# EAGLE design Board_3 (EAGLE 9.0.1)
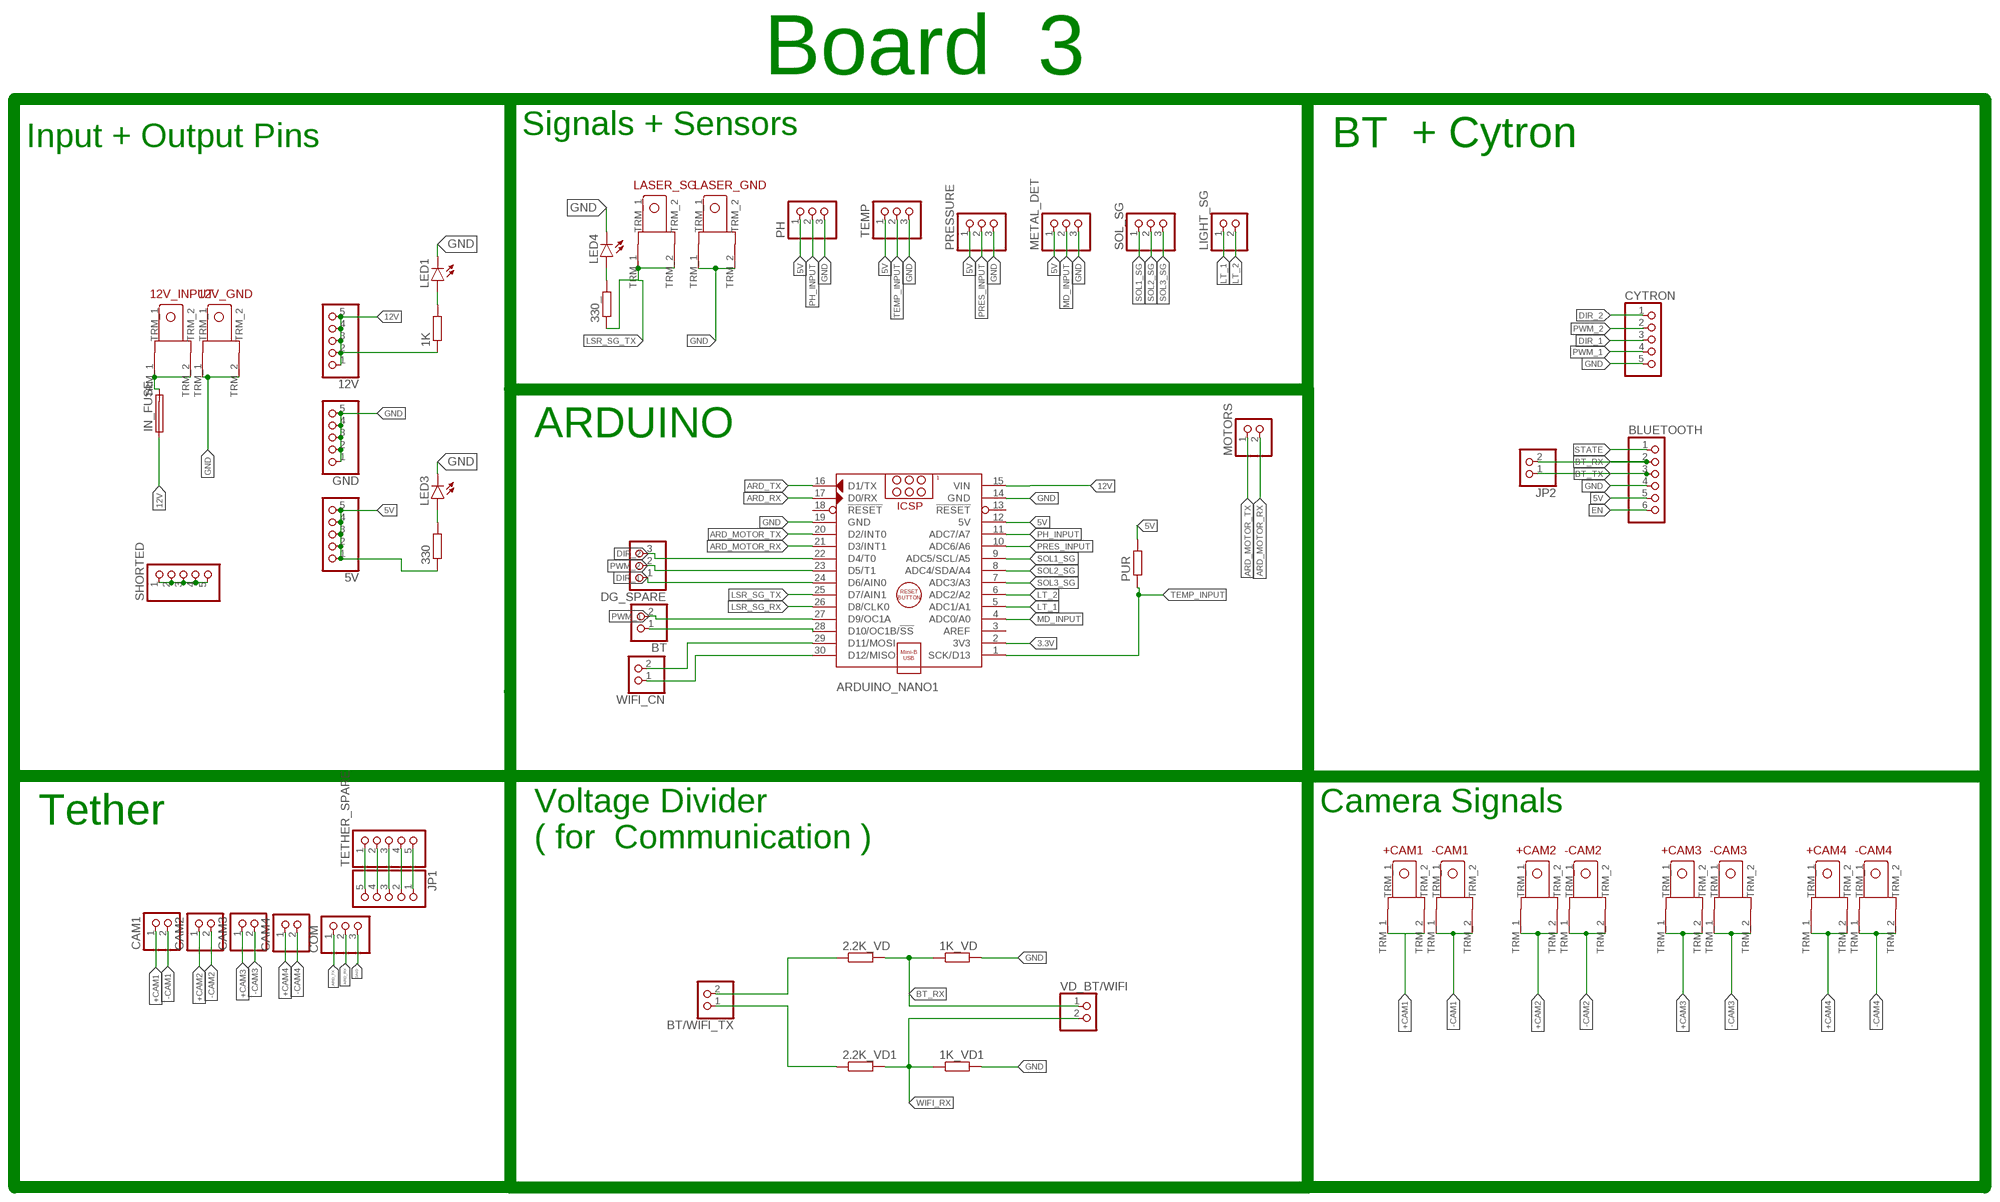
[diagram p0: schematic, sheet 1]

## Parts
1K  RESISTOR  [0207/10]
1K_VD  RESISTOR  [0207/10]
1K_VD1  RESISTOR  [0207/10]
2.2K_VD  RESISTOR  [0207/10]
2.2K_VD1  RESISTOR  [0207/10]
5V  PINHD-1X5  [1X05]
12V  PINHD-1X5  [1X05]
12V_GND  TERMINAL_EDITED  [TERMINAL_EDITED]
12V_INPUT  TERMINAL_EDITED  [TERMINAL_EDITED]
330  RESISTOR  [0207/10]
330_  RESISTOR  [0207/10]
+CAM1  TERMINAL_EDITED  [TERMINAL_EDITED]
+CAM2  TERMINAL_EDITED  [TERMINAL_EDITED]
+CAM3  TERMINAL_EDITED  [TERMINAL_EDITED]
+CAM4  TERMINAL_EDITED  [TERMINAL_EDITED]
-CAM1  TERMINAL_EDITED  [TERMINAL_EDITED]
-CAM2  TERMINAL_EDITED  [TERMINAL_EDITED]
-CAM3  TERMINAL_EDITED  [TERMINAL_EDITED]
-CAM4  TERMINAL_EDITED  [TERMINAL_EDITED]
ARDUINO_NANO1  ARDUINO_NANO  [ARDUINO_NANO]
BLUETOOTH  BLUETOOTH_HC-05  [1X06]
BT  PINHD-1X2  [1X02]
BT/WIFI_TX  PINHD-1X2  [1X02]
CAM1  PINHD-1X2  [1X02]
CAM2  PINHD-1X2  [1X02]
CAM3  PINHD-1X2  [1X02]
CAM4  PINHD-1X2  [1X02]
COM  PINHD-1X3  [1X03]
CYTRON  PINHD-1X5  [1X05]
DG_SPARE  PINHD-1X3  [1X03]
GND  PINHD-1X5  [1X05]
IN_FUSE  FUSE  [SH22,5A]
JP1  PINHD-1X5  [1X05]
JP2  PINHD-1X2  [1X02]
LASER_GND  TERMINAL_EDITED  [TERMINAL_EDITED]
LASER_SG  TERMINAL_EDITED  [TERMINAL_EDITED]
LED1  LED5MM  [LED5MM]
LED3  LED5MM  [LED5MM]
LED4  LED5MM  [LED5MM]
LIGHT_SG  PINHD-1X2  [1X02]
METAL_DET  PINHD-1X3  [1X03]
MOTORS  PINHD-1X2  [1X02]
PH  PINHD-1X3  [1X03]
PRESSURE  PINHD-1X3  [1X03]
PUR  RESISTOR  [0207/10]
SHORTED  PINHD-1X5  [1X05]
SOL_SG  PINHD-1X3  [1X03]
TEMP  PINHD-1X3  [1X03]
TETHER_SPARE  PINHD-1X5  [1X05]
VD_BT/WIFI  PINHD-1X2  [1X02]
WIFI_CN  PINHD-1X2  [1X02]

## Nets
3.3V: ARDUINO_NANO1.2(3V3)
5V: 5V.1 5V.2 5V.3 5V.4 5V.5 330.1 ARDUINO_NANO1.12(5V) BLUETOOTH.5 METAL_DET.1 PH.1 PRESSURE.1 PUR.2 TEMP.1
12V: 1K.1 12V.1 12V.2 12V.3 12V.4 12V.5 ARDUINO_NANO1.15(VIN) IN_FUSE.1
+CAM1: +CAM1.TRM_1 +CAM1.TRM_2 CAM1.1
+CAM2: +CAM2.TRM_1 +CAM2.TRM_2 CAM2.1
+CAM3: +CAM3.TRM_1 +CAM3.TRM_2 CAM3.1
+CAM4: +CAM4.TRM_1 +CAM4.TRM_2 CAM4.1
-CAM1: -CAM1.TRM_1 -CAM1.TRM_2 CAM1.2
-CAM2: -CAM2.TRM_1 -CAM2.TRM_2 CAM2.2
-CAM3: -CAM3.TRM_1 -CAM3.TRM_2 CAM3.2
-CAM4: -CAM4.TRM_1 -CAM4.TRM_2 CAM4.2
ARD_MOTOR_RX: ARDUINO_NANO1.21(D3/INT1) MOTORS.2
ARD_MOTOR_TX: ARDUINO_NANO1.20(D2/INT0) MOTORS.1
ARD_RX: ARDUINO_NANO1.17(D0/RX) COM.2
ARD_TX: ARDUINO_NANO1.16(D1/TX) COM.1
BT_RX: 1K_VD.1 2.2K_VD.2 BLUETOOTH.2 JP2.2 VD_BT/WIFI.1
BT_TX: BLUETOOTH.3 JP2.1
DIR_1: ARDUINO_NANO1.24(D6/AIN0) CYTRON.3 DG_SPARE.1
DIR_2: ARDUINO_NANO1.22(D4/T0) CYTRON.1 DG_SPARE.3
EN: BLUETOOTH.6
GND: 1K_VD1.2 1K_VD.2 12V_GND.TRM_1 12V_GND.TRM_2 ARDUINO_NANO1.14(GND) ARDUINO_NANO1.19(GND) BLUETOOTH.4 COM.3 CYTRON.5 GND.1 GND.2 GND.3 GND.4 GND.5 LASER_GND.TRM_1 LASER_GND.TRM_2 LED1.K(C) LED3.K(C) LED4.K(C) METAL_DET.3 PH.3 PRESSURE.3 TEMP.3
LSR_SG_RX: ARDUINO_NANO1.26(D8/CLK0)
LSR_SG_TX: 330_.1 ARDUINO_NANO1.25(D7/AIN1) LASER_SG.TRM_1 LASER_SG.TRM_2
LT_1: ARDUINO_NANO1.5(ADC1/A1) LIGHT_SG.1
LT_2: ARDUINO_NANO1.6(ADC2/A2) LIGHT_SG.2
MD_INPUT: ARDUINO_NANO1.4(ADC0/A0) METAL_DET.2
N$1: JP1.5 TETHER_SPARE.1
N$2: JP1.4 TETHER_SPARE.2
N$3: JP1.3 TETHER_SPARE.3
N$4: JP1.2 TETHER_SPARE.4
N$5: JP1.1 TETHER_SPARE.5
N$11: ARDUINO_NANO1.28(D10/OC1B/!SS) BT.1
N$12: ARDUINO_NANO1.29(D11/MOSI) WIFI_CN.2
N$13: ARDUINO_NANO1.30(D12/MISO) WIFI_CN.1
N$19: SHORTED.1 SHORTED.2 SHORTED.3 SHORTED.4 SHORTED.5
N$21: 330_.2 LED4.A
N$22: 2.2K_VD.1 BT/WIFI_TX.2
N$23: 1K.2 LED1.A
N$24: 2.2K_VD1.1 BT/WIFI_TX.1
N$25: 330.2 LED3.A
N$27: 12V_INPUT.TRM_1 12V_INPUT.TRM_2 IN_FUSE.2
PH_INPUT: ARDUINO_NANO1.11(ADC7/A7) PH.2
PRES_INPUT: ARDUINO_NANO1.10(ADC6/A6) PRESSURE.2
PWM_1: ARDUINO_NANO1.27(D9/OC1A) BT.2 CYTRON.4
PWM_2: ARDUINO_NANO1.23(D5/T1) CYTRON.2 DG_SPARE.2
SOL1_SG: ARDUINO_NANO1.9(ADC5/SCL/A5) SOL_SG.1
SOL2_SG: ARDUINO_NANO1.8(ADC4/SDA/A4) SOL_SG.2
SOL3_SG: ARDUINO_NANO1.7(ADC3/A3) SOL_SG.3
STATE: BLUETOOTH.1
TEMP_INPUT: ARDUINO_NANO1.1(SCK/D13) PUR.1 TEMP.2
WIFI_RX: 1K_VD1.1 2.2K_VD1.2 VD_BT/WIFI.2
Unconnected: ARDUINO_NANO1.3(AREF) ARDUINO_NANO1.13(!RESET) ARDUINO_NANO1.18(!RESET)

## Notes on the sheet
- Board  3
- Signals + Sensors
- Input + Output Pins | BT  + Cytron
- ARDUINO
- Camera Signals
- Tether
- Voltage Divider 
  ( for  Communication )

## Library data of the parts
1K 1K_VD 1K_VD1 2.2K_VD 2.2K_VD1 330 330_ PUR = 1-ROV Components:RESISTOR
5V 12V CYTRON GND JP1 SHORTED TETHER_SPARE = pinhead:PINHD-1X5: PIN HEADER
12V_GND 12V_INPUT +CAM1-+CAM4 -CAM1--CAM4 LASER_GND LASER_SG = 1-ROV Components:TERMINAL_EDITED
ARDUINO_NANO1 = 1-ROV Components:ARDUINO_NANO: Arduino Nano V3.0 Module Overview: The Arduino Nano is a small, complete, and breadboard-friendly board based on the ATmega328 (Arduino Nano 3.x) or ATmega168 (Arduino Nano 2.x). It has more or less the same functionality of the Arduino Duemilanove, but in a different package. It lacks only a DC power jack, and works with a Mini-B USB cable instead of a standard one. The Nano was designed and is being produced by Gravitech <http://www.gravitech.us/arna30wiatp.html>. General specifications: Item Value Microcontroller Atmel ATmega168 or ATmega328 Operating Voltage (logic level) 5 V Input Voltage (recommended) 7-12 V Input Voltage (limits) 6-20 V Digital I/O Pins 14 (of which 6 provide PWM output) Analog Input Pins 8 DC Current per I/O Pin 40 mA Flash Memory 16 KB (ATmega168) or 32 KB (ATmega328) of which 2 KB used by bootloader SRAM 1 KB (ATmega168) or 2 KB (ATmega328) EEPROM 512 bytes (ATmega168) or 1 KB (ATmega328) Clock Speed 16 MHz Dimensions (Inches) 0.73" x 1.70" Dimensions (mm) 18mm x 45mm Overall height About 9 mm (not including pins) Weigth 5 g Power: The Arduino Nano can be powered via the Mini-B USB connection, 6-20V unregulated external power supply (pin 30), or 5V regulated external power supply (pin 27). The power source is automatically selected to the highest voltage source. Memory: The ATmega168 has 16 KB of flash memory for storing code (of which 2 KB is used for the bootloader); the ATmega328 has 32 KB, (also with 2 KB used for the bootloader). The ATmega168 has 1 KB of SRAM and 512 bytes of EEPROM (which can be read and written with the EEPROM library); the ATmega328 has 2 KB of SRAM and 1 KB of EEPROM. Input and Output: Each of the 14 digital pins on the Nano can be used as an input or output, using pinMode(), digitalWrite(), and digitalRead() functions. They operate at 5 volts. Each pin can provide or receive a maximum of 40 mA and has an internal pull-up resistor (disconnected by default) of 20-50 kOhms. In addition, some pins have specialized functions. Visit Arduino - ArduinoBoardNano <https://www.arduino.cc/en/Main/ArduinoBoardNano>
BLUETOOTH = 1-ROV Components:BLUETOOTH_HC-05
BT BT/WIFI_TX CAM1-CAM4 JP2 LIGHT_SG MOTORS VD_BT/WIFI WIFI_CN = pinhead:PINHD-1X2: PIN HEADER
COM DG_SPARE METAL_DET PH PRESSURE SOL_SG TEMP = pinhead:PINHD-1X3: PIN HEADER
IN_FUSE = 1-ROV Components:FUSE
LED1 LED3 LED4 = led:LED: LED OSRAM: - CHIPLED LG R971, LG N971, LY N971, LG Q971, LY Q971, LO R971, LY R971 LH N974, LH R974 LS Q976, LO Q976, LY Q976 LO Q996 - Hyper CHIPLED LW Q18S LB Q993, LB Q99A, LB R99A - SideLED LS A670, LO A670, LY A670, LG A670, LP A670 LB A673, LV A673, LT A673, LW A673 LH A674 LY A675 LS A676, LA A676, LO A676, LY A676, LW A676 LS A679, LY A679, LG A679 - Hyper Micro SIDELED® LS Y876, LA Y876, LO Y876, LY Y876 LT Y87S - SmartLED LW L88C, LW L88S LB L89C, LB L89S, LG L890 LS L89K, LO L89K, LY L89K LS L896, LA L896, LO L896, LY L896 - TOPLED LS T670, LO T670, LY T670, LG T670, LP T670 LSG T670, LSP T670, LSY T670, LOP T670, LYG T670 LG T671, LOG T671, LSG T671 LB T673, LV T673, LT T673, LW T673 LH T674 LS T676, LA T676, LO T676, LY T676, LB T676, LH T676, LSB T676, LW T676 LB T67C, LV T67C, LT T67C, LS T67K, LO T67K, LY T67K, LW E67C LS E67B, LA E67B, LO E67B, LY E67B, LB E67C, LV E67C, LT E67C LW T67C LS T679, LY T679, LG T679 LS T770, LO T770, LY T770, LG T770, LP T770 LB T773, LV T773, LT T773, LW T773 LH T774 LS E675, LA E675, LY E675, LS T675 LS T776, LA T776, LO T776, LY T776, LB T776 LHGB T686 LT T68C, LB T68C - Hyper Mini TOPLED® LB M676 - Mini TOPLED Santana® LG M470 LS M47K, LO M47K, LY M47K Source: http://www.osram.convergy.de LUXEON: - LUMILED® LXK2-PW12-R00, LXK2-PW12-S00, LXK2-PW14-U00, LXK2-PW14-V00 LXK2-PM12-R00, LXK2-PM12-S00, LXK2-PM14-U00 LXK2-PE12-Q00, LXK2-PE12-R00, LXK2-PE12-S00, LXK2-PE14-T00, LXK2-PE14-U00 LXK2-PB12-K00, LXK2-PB12-L00, LXK2-PB12-M00, LXK2-PB14-N00, LXK2-PB14-P00, LXK2-PB14-Q00 LXK2-PR12-L00, LXK2-PR12-M00, LXK2-PR14-Q00, LXK2-PR14-R00 LXK2-PD12-Q00, LXK2-PD12-R00, LXK2-PD12-S00 LXK2-PH12-R00, LXK2-PH12-S00 LXK2-PL12-P00, LXK2-PL12-Q00, LXK2-PL12-R00 Source: www.luxeon.com KINGBRIGHT: KA-3528ASYC Source: www.kingbright.com

## Board
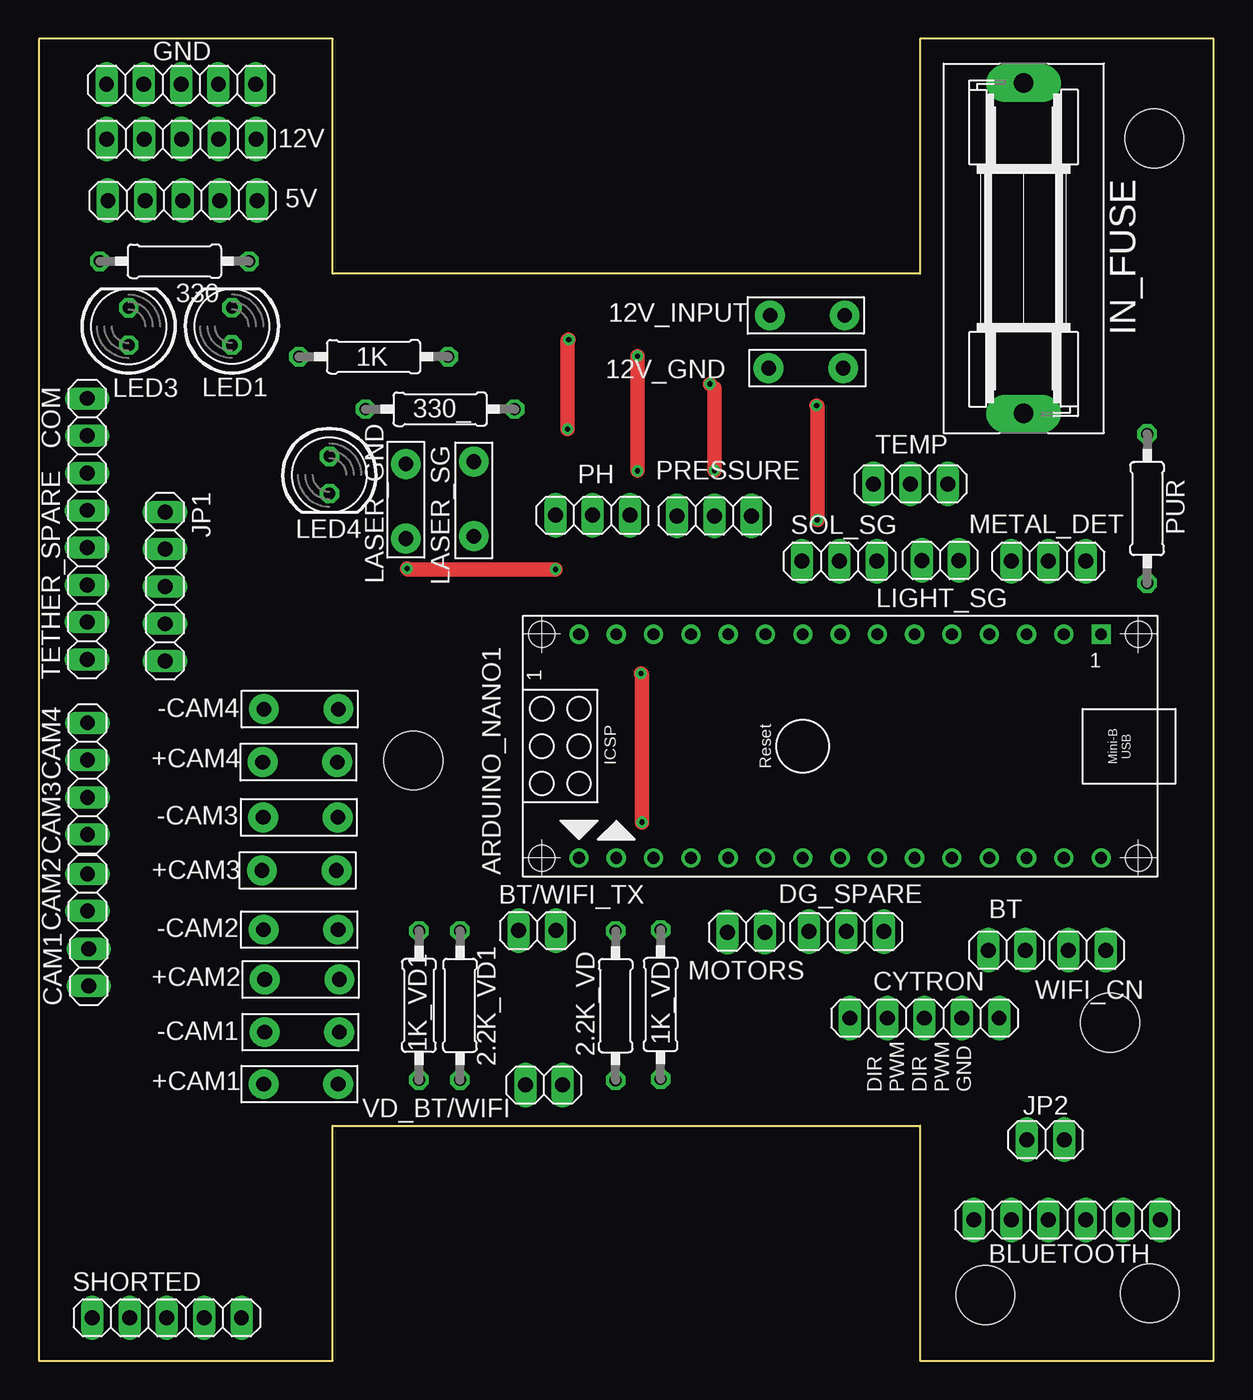
[diagram p1: board, top side]
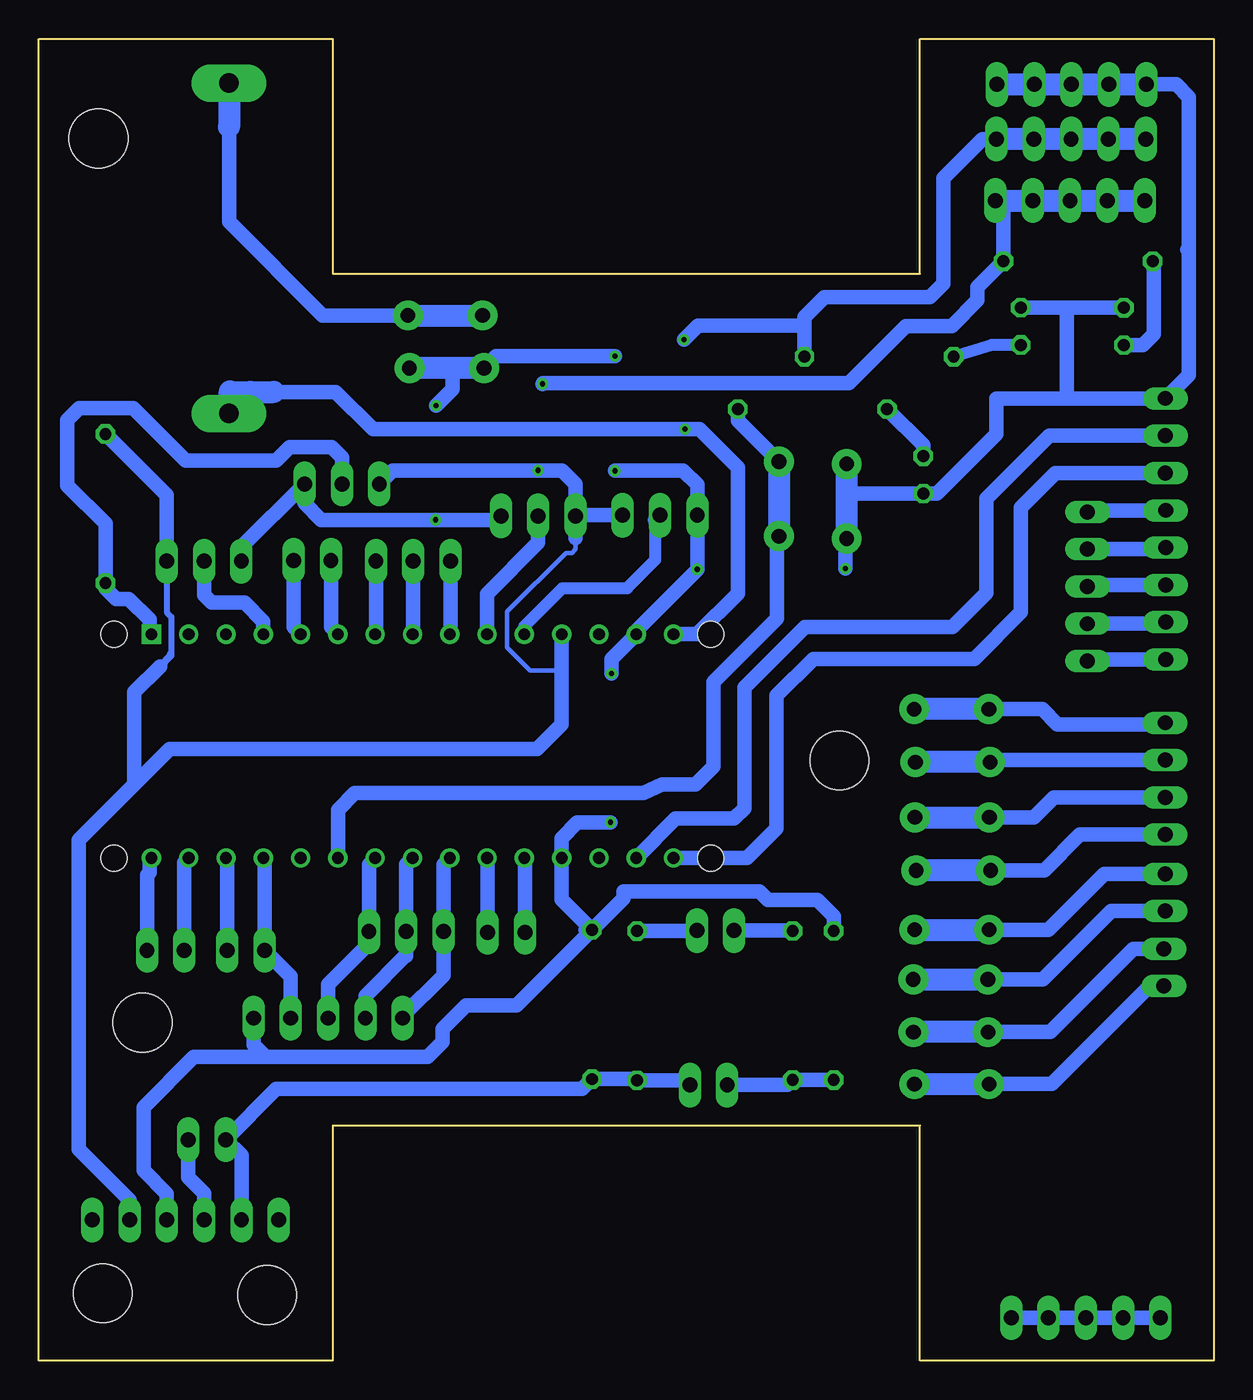
[diagram p2: board, bottom side, seen from below]

Size 80 x 90 mm. Coordinates in mm from the lower left corner, seen from the top.
Outline: 0,0 20,0 20,16 60,16 60,0 80,0 80,90 60,90 60,74 20,74 20,90 0,90 0,0
Copper layers (1*16): Top 0.035mm / dielectric 1.5mm / Bottom 0.035mm
Design rules "default": minimum track width 6mil, minimum drill 0.35mm, track to track 6mil, track to pad 6mil, pad to pad 6mil, via to via 6mil, smd to smd 6mil, copper to edge 40mil, drill to drill 6mil, minimum pad ring 10mil, minimum via ring 8mil, stop-mask expansion 4mil, vias tented up to drill 0mil, thermal gap 10mil
Holes 4 mm at 25.49,40.86 75.95,83.22 64.46,4.46 75.65,4.58 72.95,23.01

### Footprints (pad centres in the part's own frame; a part is rotated, then mirrored left to right if it is on the bottom)
0207/10 = drill 0.813 octagon: 1 -5.08,0; 2 5.08,0
1X05 = drill 1.016 long: 1 -5.08,0; 2 -2.54,0; 3 0,0; 4 2.54,0; 5 5.08,0
TERMINAL_EDITED = drill 1 pad 2.032: TRM_1 -2.54,0; TRM_2 2.54,0
ARDUINO_NANO = drill 0.8 square: 1 -20.32,-7.62 | drill 0.8: 2 -17.78,-7.62; 3 -15.24,-7.62; 4 -12.7,-7.62; 5 -10.16,-7.62; 6 -7.62,-7.62; 7 -5.08,-7.62; 8 -2.54,-7.62; 9 0,-7.62; 10 2.54,-7.62; 11 5.08,-7.62; 12 7.62,-7.62; 13 10.16,-7.62; 14 12.7,-7.62; 15 15.24,-7.62; 16 15.24,7.62; 17 12.7,7.62; 18 10.16,7.62; 19 7.62,7.62; 20 5.08,7.62; 21 2.54,7.62; 22 0,7.62; 23 -2.54,7.62; 24 -5.08,7.62; 25 -7.62,7.62; 26 -10.16,7.62; 27 -12.7,7.62; 28 -15.24,7.62; 29 -17.78,7.62; 30 -20.32,7.62 | hole 1.778: -22.86,-7.62; -22.86,7.62; 17.78,7.62; 17.78,-7.62
1X06 = drill 1.016 long: 1 -6.35,0; 2 -3.81,0; 3 -1.27,0; 4 1.27,0; 5 3.81,0; 6 6.35,0
1X02 = drill 1.016 long: 1 -1.27,0; 2 1.27,0
1X03 = drill 1.016 long: 1 -2.54,0; 2 0,0; 3 2.54,0
SH22,5A = drill 1.321 pad 2.54 long: 1 -11.252,0; 2 11.252,0
LED5MM = drill 0.813 octagon: A -1.27,0; K 1.27,0

### Placement (x,y rotation side)
1K  22.79,68.36 180 top
1K_VD  42.34,24.25 90 top
1K_VD1  25.88,24.18 90 top
2.2K_VD  39.27,24.16 270 top
2.2K_VD1  28.67,24.18 270 top
5V  9.78,78.99 0 top
12V  9.71,83.18 0 top
12V_GND  52.23,67.58 180 top
12V_INPUT  52.33,71.17 0 top
330  9.23,74.86 180 top
330_  27.32,64.79 180 top
+CAM1  17.84,18.83 0 top
+CAM2  17.92,25.95 0 top
+CAM3  17.72,33.38 0 top
+CAM4  17.77,40.75 0 top
-CAM1  17.91,22.37 0 top
-CAM2  17.83,29.34 0 top
-CAM3  17.81,36.99 0 top
-CAM4  17.86,44.36 0 top
ARDUINO_NANO1  52.02,41.84 180 top
BLUETOOTH  70.02,9.57 0 top
BT  65.91,27.94 180 top
BT/WIFI_TX  33.93,29.28 0 top
CAM1  3.39,26.77 90 top
CAM2  3.3,31.88 90 top
CAM3  3.3,37.08 90 top
CAM4  3.3,42.16 90 top
COM  3.29,62.98 90 top
CYTRON  60.31,23.32 0 top
DG_SPARE  54.99,29.21 180 top
GND  9.68,86.91 0 top
IN_FUSE  67.06,75.74 90 top
JP1  8.59,52.71 270 top
JP2  68.56,15.04 180 top
LASER_GND  24.99,58.52 270 top
LASER_SG  29.61,58.68 90 top
LED1  13.14,70.43 90 top
LED3  6.11,70.42 90 top
LED4  19.78,60.31 270 top
LIGHT_SG  61.39,54.49 180 top
METAL_DET  68.75,54.44 180 top
MOTORS  48.16,29.16 0 top
PH  37.71,57.56 180 top
PRESSURE  46,57.52 0 top
PUR  75.47,58.02 90 top
SHORTED  8.71,2.91 0 top
SOL_SG  54.52,54.44 0 top
TEMP  59.36,59.7 0 top
TETHER_SPARE  3.27,52.82 90 top
VD_BT/WIFI  34.4,18.76 180 top
WIFI_CN  71.37,27.94 180 top

### Tracks (layer width: path | path; a pad name or v marks a point on that pad's centre or on a via)
5V  (via drill 0.35)
  Top 1: v45.7,66.51 46,66.21 v46,60.62
  Bottom 0.305: 44.4,47 46.57,47 48.11,48.54 48.11,51 44.11,55 43.71,55 43.46,55.25 43.46,56
  Bottom 0.406: METAL_DET.1 71.29,50.95 70.99,50.65 70.99,48.16 71.02,48.13
  Bottom 0.508: 71.02,48.13 71.02,48 71.74,47.28
  Bottom 1: ARDUINO_NANO1.12 44.4,47 44.4,43.33 46.08,41.65 71.09,41.65 73.5,39.24 | 73.5,39.24 77.28,35.45 77.28,14.38 73.83,10.92 BLUETOOTH.5 | METAL_DET.1 71.29,58.92 PUR.2 | PRESSURE.1 43.41,57.56 PH.1 | PRESSURE.1 43.46,59.7 44.38,60.62 v46,60.62 55.9,60.62 TEMP.1 | 71.74,47.28 73.5,45.52 73.5,39.24 | PRESSURE.1 43.46,56 | 5V.5 14.31,78.44 330.1 16.08,73.09 16.08,72.2 17.84,70.44 20.95,70.44 24.84,66.55 45.66,66.55 v45.7,66.51
  Bottom 1.5: 5V.5 5V.4 5V.3 5V.2 5V.1
12V  (via drill 0.35)
  Top 1: v36,63.42 36,69.44 v36.08,69.52
  Bottom 1: ARDUINO_NANO1.15 35.19,49.46 32.41,52.24 32.41,60.8 35.03,63.42 v36,63.42 57.25,63.42 59.79,65.96 64,65.96 | 1K.1 27.87,70.47 | 27.87,70.47 27.87,71.06 26.52,72.41 19.34,72.41 18.41,73.34 18.41,80.52 15.75,83.18 12V.5 | v36.08,69.52 35.13,70.47 27.87,70.47
  Bottom 1.5: 65.59,65.96 IN_FUSE.1 67,64.55 67,66 66.96,65.96 65.59,65.96 | 65.59,65.96 64,65.96 | 12V.1 12V.2 12V.3 12V.4 12V.5
+CAM1
  Bottom 1: +CAM1.TRM_1 11.01,18.83 4.34,25.5 CAM1.1
  Bottom 1.5: +CAM1.TRM_2 +CAM1.TRM_1
+CAM2
  Bottom 1: +CAM2.TRM_1 11.62,25.95 6.96,30.61 CAM2.1
  Bottom 1.5: +CAM2.TRM_2 +CAM2.TRM_1
+CAM3
  Bottom 1: +CAM3.TRM_1 11.54,33.38 9.11,35.81 CAM3.1
  Bottom 1.5: +CAM3.TRM_1 +CAM3.TRM_2
+CAM4
  Bottom 1: CAM4.1 15.09,40.89 +CAM4.TRM_1
  Bottom 1.5: +CAM4.TRM_1 +CAM4.TRM_2
-CAM1
  Bottom 1: CAM1.2 5.46,28.04 11.13,22.37 -CAM1.TRM_1
  Bottom 1.5: -CAM1.TRM_1 -CAM1.TRM_2
-CAM2
  Bottom 1: CAM2.2 7.45,33.15 11.26,29.34 -CAM2.TRM_1
  Bottom 1.5: -CAM2.TRM_2 -CAM2.TRM_1
-CAM3
  Bottom 1: 15.05,37.21 -CAM3.TRM_1 | -CAM3.TRM_1 -CAM3.TRM_2 | CAM3.2 10.88,38.35 12.24,36.99 15,36.99 -CAM3.TRM_1
  Bottom 1.5: -CAM3.TRM_2 15,36.99
-CAM4
  Bottom 1: -CAM4.TRM_1 11.68,44.36 10.63,43.31 3.43,43.31 CAM4.2
  Bottom 1.5: -CAM4.TRM_1 -CAM4.TRM_2
ARD_MOTOR_RX
  Bottom 1: MOTORS.2 49.44,34.17 ARDUINO_NANO1.21
ARD_MOTOR_TX
  Bottom 1: MOTORS.1 46.9,34.17 ARDUINO_NANO1.20
ARD_RX
  Bottom 1: COM.2 11.19,62.98 15.47,58.7 15.47,52.27 17.8,49.94 27.85,49.94 31.96,45.83 31.96,37.6 32.66,36.9 36.64,36.9 ARDUINO_NANO1.17
ARD_TX
  Bottom 1: ARDUINO_NANO1.16 31.78,34.22 29.76,36.24 29.76,45.28 27.25,47.79 16.31,47.79 13.12,50.98 13.12,58.1 10.78,60.44 COM.1
BT_RX
  Bottom 1: VD_BT/WIFI.1 35.99,19.08 2.2K_VD.2 39.35,19.17 1K_VD.1 43,18.5 63.83,18.5 JP2.2 66.21,13.96 BLUETOOTH.2
BT_TX
  Bottom 1: JP2.1 69.83,12.47 68.74,11.38 BLUETOOTH.3
DIR_1
  Bottom 1: ARDUINO_NANO1.24 57.53,33.79 DG_SPARE.1 57.53,28.41 60.31,25.63 CYTRON.3
DIR_2
  Bottom 1: ARDUINO_NANO1.22 52.45,33.79 DG_SPARE.3 52.45,27 52.45,26.63 52.45,26.24 55.23,23.46 CYTRON.1
GND  (via drill 0.35)
  Top 1: v41.07,36.66 41.07,46.72 v41,46.79 | v40.77,60.59 v40.77,68.41 | v52.96,65.04 53,65 v53,57.25 | v35.17,53.88 25.13,53.88 v25.07,53.94
  Bottom 1: CYTRON.5 65.39,21.51 64.55,20.67 | 42.79,29.33 1K_VD.2 | 1K_VD1.2 25.88,30.24 27,31.36 30.36,31.36 30.93,31.93 40.19,31.93 40.19,31.47 1K_VD.2 | GND.1 2.56,86.91 1.69,86.04 1.69,75.53 | 1.69,75.53 1.69,67.12 COM.3 10,65.52 | METAL_DET.3 66.21,55.39 TEMP.3 61.9,58.38 60.77,57.25 v53,57.25 48.8,57.25 PRESSURE.3 | ARDUINO_NANO1.14 39.18,49.32 | 12V_GND.TRM_1 51.83,67.58 | 51.83,67.58 12V_GND.TRM_2 48.86,68.41 v40.77,68.41 | ARDUINO_NANO1.14 39.32,49.73 v35.17,53.88 PH.3 35.17,59.64 36.15,60.62 40.74,60.62 v40.77,60.59 | v41.07,36.66 41.1,36.63 43.34,36.63 44.4,35.57 ARDUINO_NANO1.19 44.4,31.39 1K_VD.2 | v41,46.79 41,47.78 ARDUINO_NANO1.14 | LED3.K 10,71.7 | 10,71.7 LED1.K | 1.81,75.65 1.69,75.53 | LASER_GND.TRM_1 25.03,59.03 LED4.K 18.85,59.04 14.81,63.08 14.81,65.52 10,65.52 | v52.96,65.04 51.83,66.17 51.83,67.58 | 10,65.52 10,71.7 | v25.07,53.94 25.07,55.9 LASER_GND.TRM_2 | 1K_VD.2 47.47,24.19 50.92,24.19 52.52,22.59 52.52,21.69 53.54,20.67 64.55,20.67 | BLUETOOTH.4 71.29,11.35 72.88,12.94 72.88,17.25 69.46,20.67 64.55,20.67
  Bottom 1.5: 12V_GND.TRM_2 12V_GND.TRM_1 | GND.5 GND.4 GND.3 GND.2 GND.1 | LASER_GND.TRM_2 LASER_GND.TRM_1
LSR_SG_TX
  Bottom 1: ARDUINO_NANO1.25 59.64,37.51 58.49,38.66 38.83,38.64 37.58,39.24 35.29,39.24 34.07,40.46 34.07,46.2 29.73,50.54 29.73,56.02 LASER_SG.TRM_1 | 330_.1 32.4,64.01 LASER_SG.TRM_2
  Bottom 1.5: LASER_SG.TRM_2 LASER_SG.TRM_1
LT_1
  Bottom 1: LIGHT_SG.1 62.66,49.94 ARDUINO_NANO1.5
LT_2
  Bottom 1: LIGHT_SG.2 60.12,49.94 ARDUINO_NANO1.6
MD_INPUT
  Bottom 1: ARDUINO_NANO1.4 64.72,50.34 66,51.62 68.23,51.62 68.75,52.14 METAL_DET.2
N$1
  Bottom 1: TETHER_SPARE.1 8.48,47.74 JP1.5
N$2
  Bottom 1: JP1.4 3.38,50.17 TETHER_SPARE.2
N$3
  Bottom 1: TETHER_SPARE.3 8.48,52.82 JP1.3
N$4
  Bottom 1: JP1.2 3.38,55.25 TETHER_SPARE.4
N$5
  Bottom 1: TETHER_SPARE.5 8.48,57.9 JP1.1
N$6
  Bottom 0.152: 0,0 20,0 20,16 60,16 60,0 80,0 80,90 60,90 60,74 20,74 20,90 0,90 0,0
N$11
  Bottom 1: BT.1 67.18,34.14 ARDUINO_NANO1.28
N$12
  Bottom 1: WIFI_CN.2 70.1,33.92 ARDUINO_NANO1.29
N$13
  Bottom 1: WIFI_CN.1 72.64,33.05 72.47,33.22 72.47,34.09 ARDUINO_NANO1.30
N$19
  Bottom 1: SHORTED.5 SHORTED.4 SHORTED.3 SHORTED.2 SHORTED.1
N$21
  Bottom 1: 330_.2 19.78,62.33 LED4.A
N$22
  Bottom 1: 2.2K_VD.1 35.24,29.24 BT/WIFI_TX.2
N$23
  Bottom 0.813: LED1.A 15.13,69.16 1K.2
N$24
  Bottom 1: BT/WIFI_TX.1 28.69,29.28 2.2K_VD1.1
N$25
  Bottom 1: LED3.A 4.83,69.15 4.08,69.9 4.08,74.79 330.2
N$27
  Bottom 1: 12V_INPUT.TRM_2 60.68,71.17 67.06,77.55 67.06,84
  Bottom 1.5: 12V_INPUT.TRM_2 12V_INPUT.TRM_1 | IN_FUSE.2 67.06,84
PH_INPUT
  Bottom 0.8: ARDUINO_NANO1.11 46.94,50.02 44.36,52.6 39.95,52.6 38.03,54.52 38.03,57.24
  Bottom 1: PH.2 38.03,57.24
PRES_INPUT
  Bottom 1: PRESSURE.2 46,55.69 49.48,52.21 ARDUINO_NANO1.10
PWM_1
  Bottom 1: ARDUINO_NANO1.27 64.64,34.14 BT.2 62.85,26.15 CYTRON.4
PWM_2
  Bottom 1: DG_SPARE.2 54.99,33.79 ARDUINO_NANO1.23 | 54.99,27.55 DG_SPARE.2 | DG_SPARE.2 54.99,27.61 57.77,24.83 CYTRON.2
SOL1_SG
  Bottom 1: SOL_SG.1 51.98,49.51 ARDUINO_NANO1.9
SOL2_SG
  Bottom 1: SOL_SG.2 54.52,49.51 ARDUINO_NANO1.8
SOL3_SG
  Bottom 1: SOL_SG.3 57.05,49.51 ARDUINO_NANO1.7
TEMP_INPUT
  Bottom 1: 72.47,49.33 ARDUINO_NANO1.1 72.47,49.59 72.47,50.46 73.88,51.87 74.75,51.87 75.47,52.59 PUR.1 75.47,57 78.07,59.6 78.07,64.05 77.26,64.86 73.59,64.86 70.01,61.28 63.84,61.28 62.92,62.2 60.06,62.2 59.36,61.5 TEMP.2
WIFI_RX
  Bottom 1: VD_BT/WIFI.2 29.01,18.76 2.2K_VD1.2 1K_VD1.1

### Text on the board
tNames: DIR / PWM / DIR / PWM / GND